# Altium schematic sheet Public_QSGMII_ETHERNET.SchDoc
size D
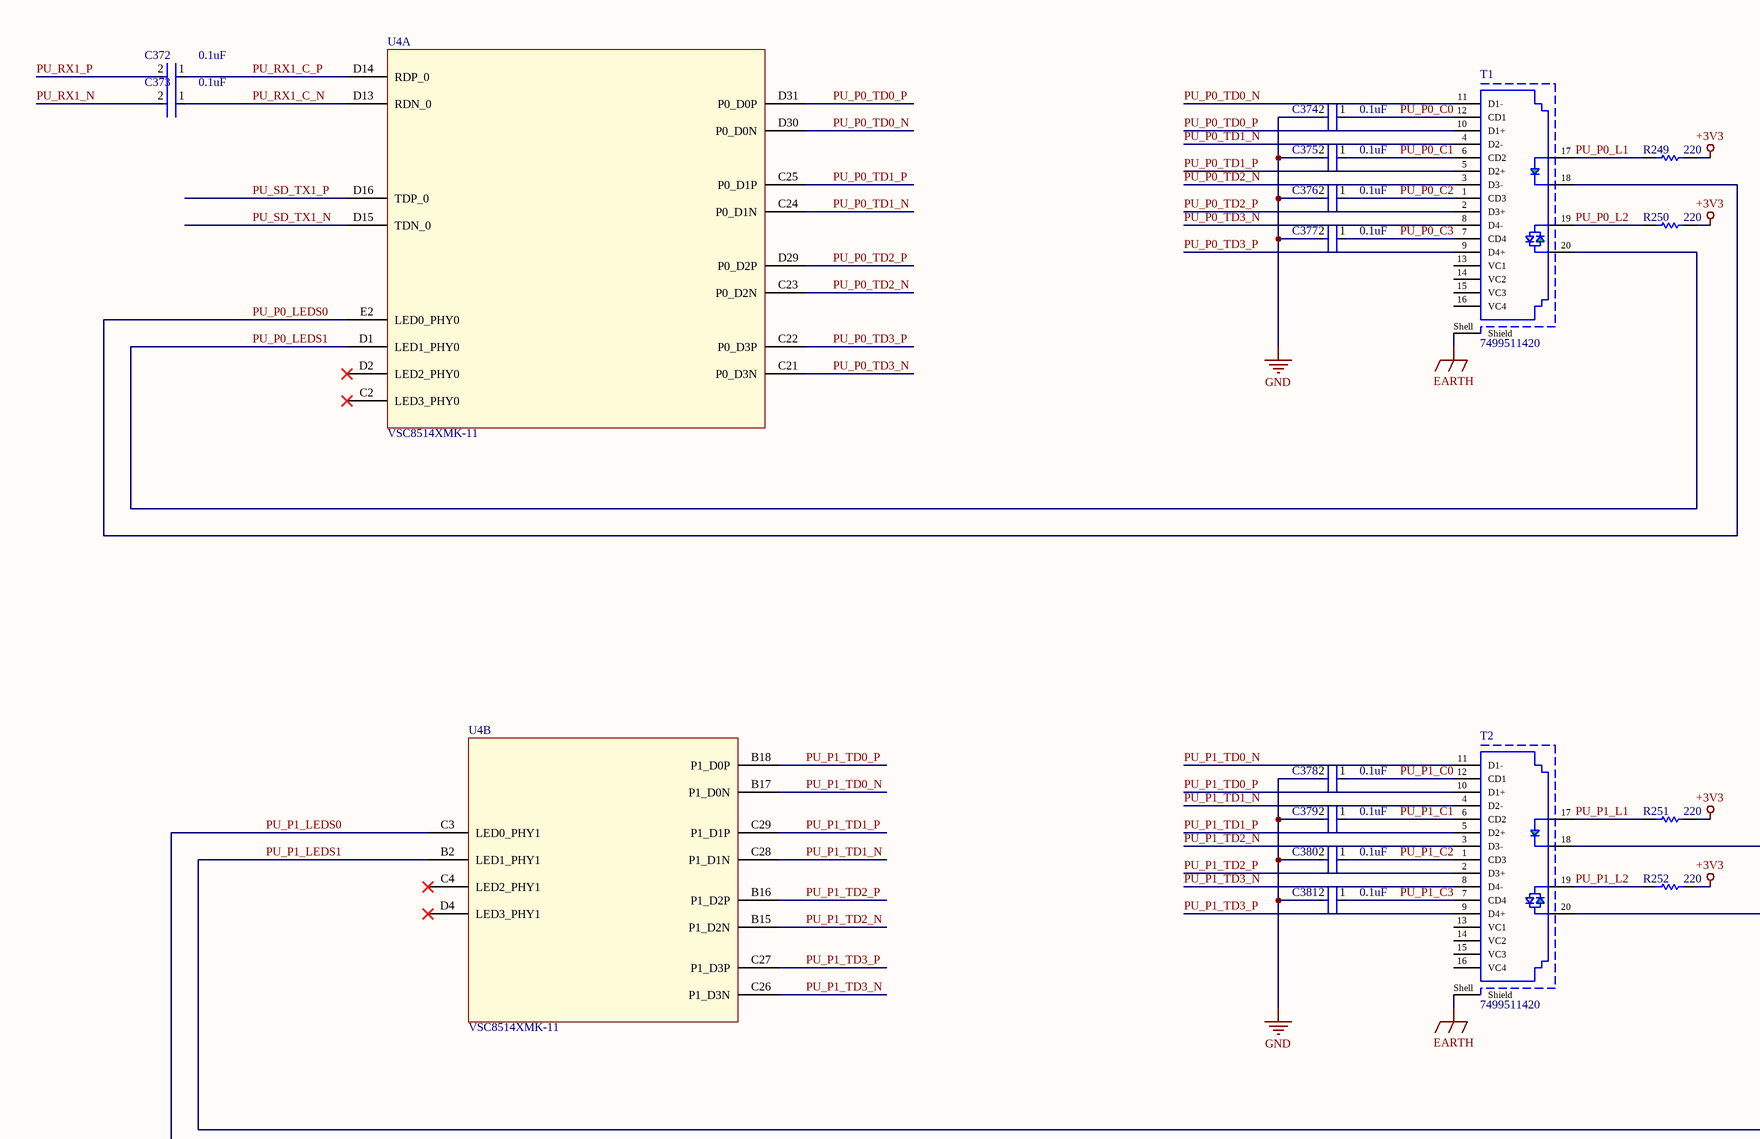
[diagram p0: Public_QSGMII_ETHERNET.SchDoc, top left]
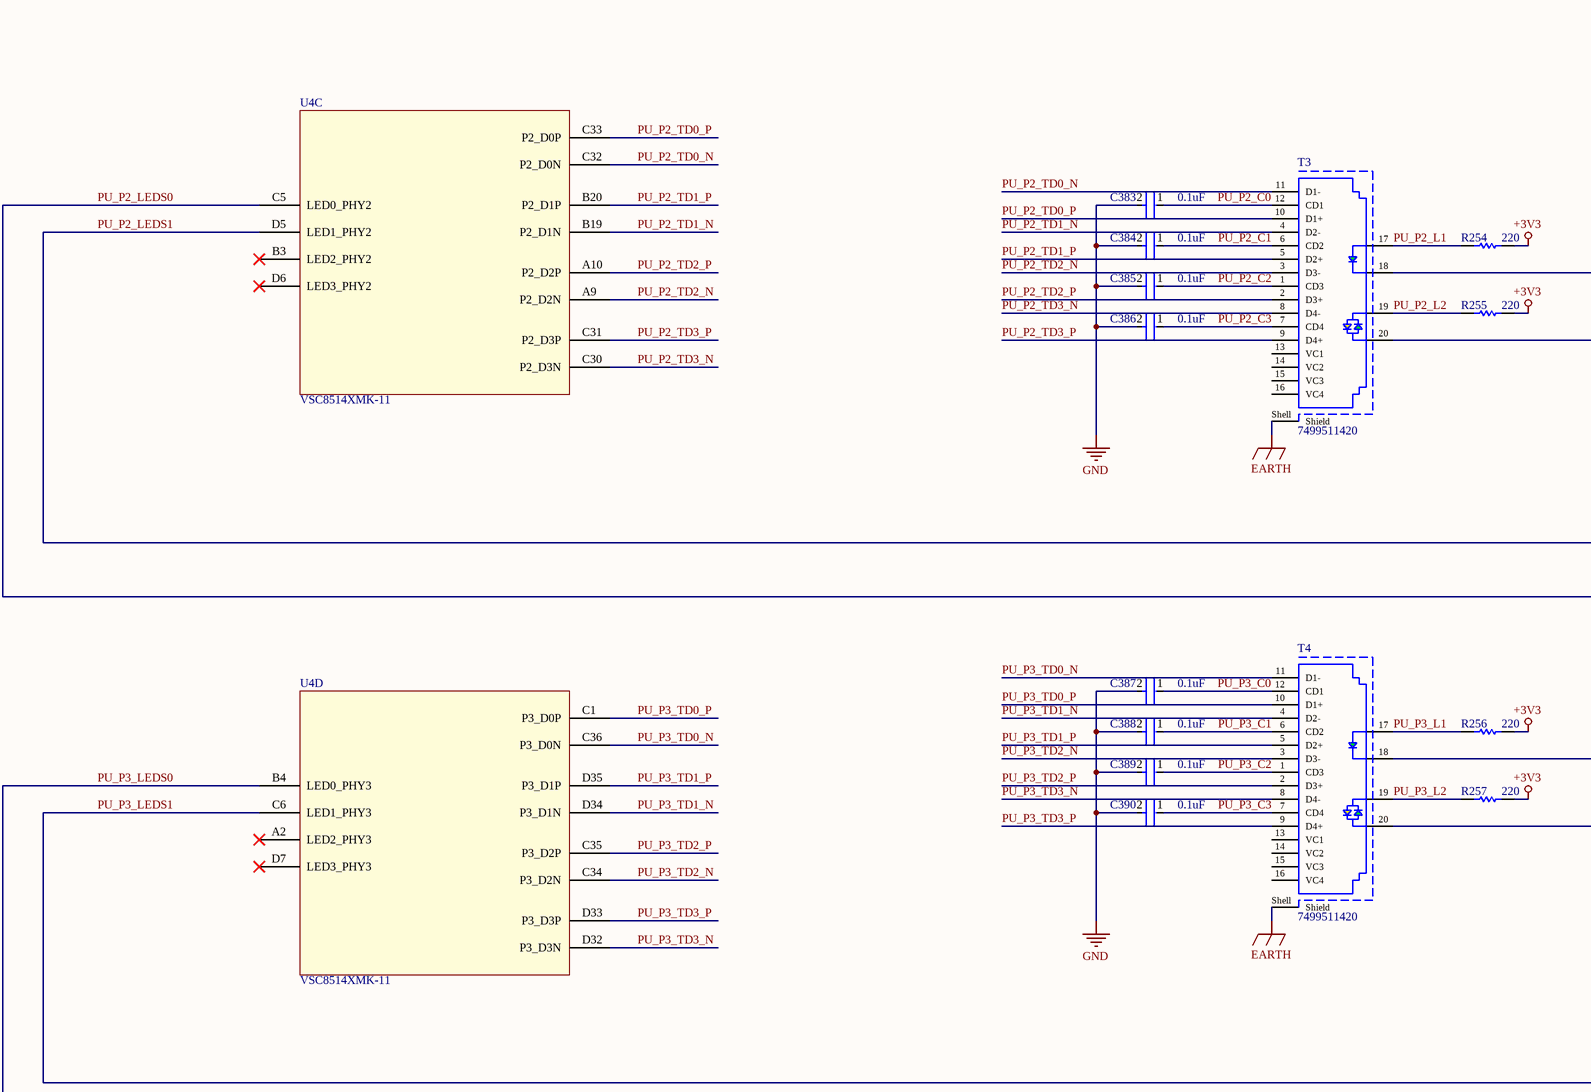
[diagram p1: Public_QSGMII_ETHERNET.SchDoc, bottom left]
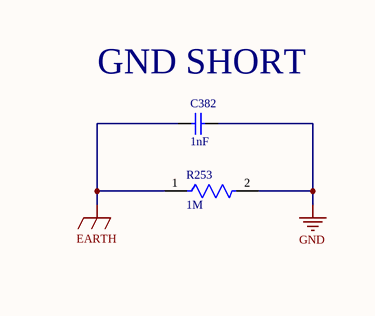
[diagram p2: Public_QSGMII_ETHERNET.SchDoc, bottom right]

## Parts
C372  0.1uF  [FP-GRM15-MFG]
C373  0.1uF  [FP-GRM15-MFG]
C374  0.1uF  [FP-GRM15-MFG]
C375  0.1uF  [FP-GRM15-MFG]
C376  0.1uF  [FP-GRM15-MFG]
C377  0.1uF  [FP-GRM15-MFG]
C378  0.1uF  [FP-GRM15-MFG]
C379  0.1uF  [FP-GRM15-MFG]
C380  0.1uF  [FP-GRM15-MFG]
C381  0.1uF  [FP-GRM15-MFG]
C382  1nF  [YAGE-CC1206KKX7R-2_M]
C383  0.1uF  [FP-GRM15-MFG]
C384  0.1uF  [FP-GRM15-MFG]
C385  0.1uF  [FP-GRM15-MFG]
C386  0.1uF  [FP-GRM15-MFG]
C387  0.1uF  [FP-GRM15-MFG]
C388  0.1uF  [FP-GRM15-MFG]
C389  0.1uF  [FP-GRM15-MFG]
C390  0.1uF  [FP-GRM15-MFG]
R249  220  [RESC3216X60X45ML10T20]
R250  220  [RESC3216X60X45ML10T20]
R251  220  [RESC3216X60X45ML10T20]
R252  220  [RESC3216X60X45ML10T20]
R253  1M  [FP-CRCW2512-e3-IPC_C]
R254  220  [RESC3216X60X45ML10T20]
R255  220  [RESC3216X60X45ML10T20]
R256  220  [RESC3216X60X45ML10T20]
R257  220  [RESC3216X60X45ML10T20]
T1  7499511420  [7499511420]
T2  7499511420  [7499511420]
T3  7499511420  [7499511420]
T4  7499511420  [7499511420]
U4  VSC8514XMK-11  [QFN138_12X12X0P85_MCH]  (parts A,B,C,D of 6)

## Nets
+3V3: R249.2 R250.2 R251.2 R252.2 R254.2 R255.2 R256.2 R257.2
EARTH: C382.1 R253.1 T1.Shell(Shield) T2.Shell(Shield) T3.Shell(Shield) T4.Shell(Shield)
GND: C374.2 C375.2 C376.2 C377.2 C378.2 C379.2 C380.2 C381.2 C382.2 C383.2 C384.2 C385.2 C386.2 C387.2 C388.2 C389.2 C390.2 R253.2
PU_P0_C0: C374.1 T1.12(CD1)
PU_P0_C1: C375.1 T1.6(CD2)
PU_P0_C2: C376.1 T1.1(CD3)
PU_P0_C3: C377.1 T1.7(CD4)
PU_P0_L1: R249.1 T1.17
PU_P0_L2: R250.1 T1.19
PU_P0_LEDS0: T1.18 U4.E2(LED0_PHY0)
PU_P0_LEDS1: T1.20 U4.D1(LED1_PHY0)
PU_P0_TD0_N: T1.11(D1-) U4.D30(P0_D0N)
PU_P0_TD0_P: T1.10(D1+) U4.D31(P0_D0P)
PU_P0_TD1_N: T1.4(D2-) U4.C24(P0_D1N)
PU_P0_TD1_P: T1.5(D2+) U4.C25(P0_D1P)
PU_P0_TD2_N: T1.3(D3-) U4.C23(P0_D2N)
PU_P0_TD2_P: T1.2(D3+) U4.D29(P0_D2P)
PU_P0_TD3_N: T1.8(D4-) U4.C21(P0_D3N)
PU_P0_TD3_P: T1.9(D4+) U4.C22(P0_D3P)
PU_P1_C0: C378.1 T2.12(CD1)
PU_P1_C1: C379.1 T2.6(CD2)
PU_P1_C2: C380.1 T2.1(CD3)
PU_P1_C3: C381.1 T2.7(CD4)
PU_P1_L1: R251.1 T2.17
PU_P1_L2: R252.1 T2.19
PU_P1_LEDS0: T2.18 U4.C3(LED0_PHY1)
PU_P1_LEDS1: T2.20 U4.B2(LED1_PHY1)
PU_P1_TD0_N: T2.11(D1-) U4.B17(P1_D0N)
PU_P1_TD0_P: T2.10(D1+) U4.B18(P1_D0P)
PU_P1_TD1_N: T2.4(D2-) U4.C28(P1_D1N)
PU_P1_TD1_P: T2.5(D2+) U4.C29(P1_D1P)
PU_P1_TD2_N: T2.3(D3-) U4.B15(P1_D2N)
PU_P1_TD2_P: T2.2(D3+) U4.B16(P1_D2P)
PU_P1_TD3_N: T2.8(D4-) U4.C26(P1_D3N)
PU_P1_TD3_P: T2.9(D4+) U4.C27(P1_D3P)
PU_P2_C0: C383.1 T3.12(CD1)
PU_P2_C1: C384.1 T3.6(CD2)
PU_P2_C2: C385.1 T3.1(CD3)
PU_P2_C3: C386.1 T3.7(CD4)
PU_P2_L1: R254.1 T3.17
PU_P2_L2: R255.1 T3.19
PU_P2_LEDS0: T3.18 U4.C5(LED0_PHY2)
PU_P2_LEDS1: T3.20 U4.D5(LED1_PHY2)
PU_P2_TD0_N: T3.11(D1-) U4.C32(P2_D0N)
PU_P2_TD0_P: T3.10(D1+) U4.C33(P2_D0P)
PU_P2_TD1_N: T3.4(D2-) U4.B19(P2_D1N)
PU_P2_TD1_P: T3.5(D2+) U4.B20(P2_D1P)
PU_P2_TD2_N: T3.3(D3-) U4.A9(P2_D2N)
PU_P2_TD2_P: T3.2(D3+) U4.A10(P2_D2P)
PU_P2_TD3_N: T3.8(D4-) U4.C30(P2_D3N)
PU_P2_TD3_P: T3.9(D4+) U4.C31(P2_D3P)
PU_P3_C0: C387.1 T4.12(CD1)
PU_P3_C1: C388.1 T4.6(CD2)
PU_P3_C2: C389.1 T4.1(CD3)
PU_P3_C3: C390.1 T4.7(CD4)
PU_P3_L1: R256.1 T4.17
PU_P3_L2: R257.1 T4.19
PU_P3_LEDS0: T4.18 U4.B4(LED0_PHY3)
PU_P3_LEDS1: T4.20 U4.C6(LED1_PHY3)
PU_P3_TD0_N: T4.11(D1-) U4.C36(P3_D0N)
PU_P3_TD0_P: T4.10(D1+) U4.C1(P3_D0P)
PU_P3_TD1_N: T4.4(D2-) U4.D34(P3_D1N)
PU_P3_TD1_P: T4.5(D2+) U4.D35(P3_D1P)
PU_P3_TD2_N: T4.3(D3-) U4.C34(P3_D2N)
PU_P3_TD2_P: T4.2(D3+) U4.C35(P3_D2P)
PU_P3_TD3_N: T4.8(D4-) U4.D32(P3_D3N)
PU_P3_TD3_P: T4.9(D4+) U4.D33(P3_D3P)
PU_RX1_C_N: C373.1 U4.D13(RDN_0)
PU_RX1_C_P: C372.1 U4.D14(RDP_0)
PU_RX1_N: C373.2
PU_RX1_P: C372.2
PU_SD_TX1_N: U4.D15(TDN_0)
PU_SD_TX1_P: U4.D16(TDP_0)

Not connected (* = marked no-connect by the designer): T1 13(VC1) 14(VC2) 15(VC3) 16(VC4); T2 13(VC1) 14(VC2) 15(VC3) 16(VC4); T3 13(VC1) 14(VC2) 15(VC3) 16(VC4); T4 13(VC1) 14(VC2) 15(VC3) 16(VC4); U4 A2(LED2_PHY3)* B3(LED2_PHY2)* C2(LED3_PHY0)* C4(LED2_PHY1)* D2(LED2_PHY0)* D4(LED3_PHY1)* D6(LED3_PHY2)* D7(LED3_PHY3)*

## Notes on the sheet
- (near C382) GND SHORT
- Title
- Size:
- Date:
- File:
- D
- Number:
- Time:
- Revision:
- Sheet
- of

## Library data of the parts
C372-C381 C383-C390 = CMP-2100-03641-2: CAP CER 0.1UF 16V X7R 0402; Manufacturer Part Number: GRM155R71C104KA88D; Manufacturer: Murata; Standoff Height: 0mm; Tolerance: 10%; Voltage Rating: 16Vdc; Material: Ceramic; Capacitance: 0.10μF; Value: 0.10μF; RoHS: TRUE; Temperature Characteristic: X7R; Octopart: https://octopart.com/grm155r71c104ka88d-murata-196880; Digikey Description: CAP CER 0.1UF 16V X7R 0402; Device Class L3: Ceramic Capacitors; Height: 0.55mm; ComponentLink2Description: Datasheet; Temperature Range Low: -55°C; Ipc Land Pattern Name: CAPC10050X219; ComponentLink2URL: https://search.murata.co.jp/Ceramy/image/img/A01X/G101/ENG/GRM155R71H471KA01-01A.pdf; Device Class L1: Passive Components; Lead Free: yes; Category: Cap; Package: GRM15; Temperature: -55°C to +125°C; Device Class L2: Capacitors; Temperature Range High: +125°C; Mouser Description: 0402 0.1 uF 16V ±10 % Tolerance X7R SMT Multilayer Ceramic Capacitor
C382 = CMP-2000-05436-1: CAP, Ceramic, 1 nF, 2000 V, 10%, 1206, RoHS, Tape and Reel; Manufacturer: Yageo; Voltage - Rated: 2000V(2kV); Other Names: 311-1487-6; Product Training Modules: MultilayerCeramicCapacitors; Online Catalog: CCSeries; Capacitance: 1000pF; Temperature Coefficient: X7R; Operating Temperature: -55degC~125degC; Size / Dimension: 0.126"Lx0.063"W(3.20mmx1.60mm); Height - Seated (Max): -; Category: Capacitors; Lead Style: -; Packaging: Digi-Reel; Tolerance: ±10%; Ratings: -; Datasheet URL: http://datasheet.octopart.com/CC1206KKX7RDBB102-Yageo-datasheet-11521487.pdf; Applications: GeneralPurpose; Datasheet Version: Rev. 4, 08/2011; Series: CC; Package / Case: 1206(3216Metric); Mounting Type: SurfaceMount,MLCC; Standard Package: 1; Thickness (Max): 0.057"(1.45mm); Lead Spacing: -; Features: -; Manufacturer URL: http://www.yageo.com/; Family: CeramicCapacitors
R249-R252 R254-R257 = CMP-2003-01956-1: Manufacturer: Vishay Dale; Part Number: CRCW1206220RFKEA
R253 = CMP-02407-006956-1: RES Thick Film, 1Ω, 1%, 1W, 100ppm/°C, 2512; Resistance: 1R; Voltage Rating: 500V; Number of Terminations: 2; Packaging: Tape and Reel; Features: Automotive AEC-Q200; Military Standard: Not; Power Rating: 1W; Max Operating Temperature: 155°C; Number of Pins: 2; Radiation Hardening: No; Mount: Surface Mount; Height: 0.6mm; Max Power Dissipation: 1W; Case Code (Metric): 6432; Termination: SMD/SMT; REACH SVHC: No SVHC; Case/Package: 2512; Weight: 0.001429oz; Tolerance: 1%; Package Quantity: 2000; Composition: Thick Film; Temperature Coefficient: 100ppm/°C; Voltage Rating (DC): 500V; Width: 0.124inch; Length: 6.3mm; Lead Free: Lead Free; Min Operating Temperature: -55°C; Contact Plating: Tin; Case Code (Imperial): 2512; Depth: 3.15mm
T1-T4 = 7499511420: WE-RJ45 LAN Transformer, THT, 10/100/1000 Base-T, Port 1x1, Tab Up; Manufacturer: Wurth Elektronik; PoE: 1000mA; LED: green/orange-yellow; USB: No; Shield Tabs: Yes; ComponentLink1Description: Manufacturer; ComponentLink1URL: http://www.we-online.de; ComponentLink2Description: Datasheet; ComponentLink2URL: https://www.we-online.com/catalog/datasheet/7499511420.pdf; Manufacturer Part Number: 7499511420; Published Date: October 2020; Tab: Up; Port Number: 1x1; Data Rate: 10/100/1000 Base-T; Operating Temperature: -40 to +85degC; Mounting Technology: THT; Packaging: Tray; HPLE: No
U4 = VSC8514XMK-11: No Description Available; pin to pad: C24>none; SourceLibrary: Microchip_2020-10-14; Built_By: EMA_Cory; Vendor: Microchip; Datasheet: https://ww1.microchip.com/downloads/en/DeviceDoc/VMDS-10446.pdf; Copyright: Copyright (C) 2018 Accelerated Designs. All rights reserved; Manufacturer_Part_Number: VSC8514XMK-11; RefDes: RefDes; Type: DEV